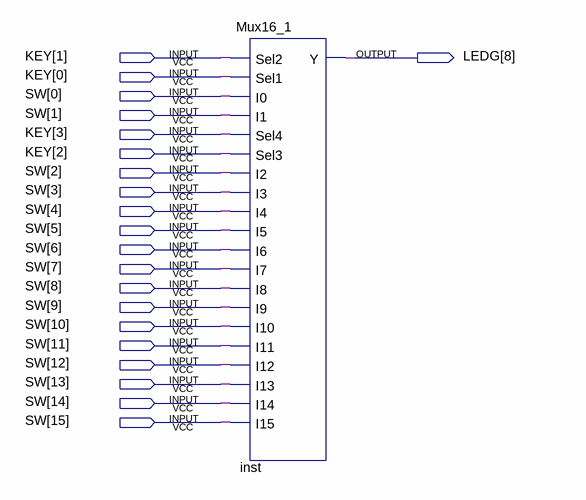
[diagram p0: schematic sheet]
// Quartus schematic MuxDemo.bdf as structural Verilog: 1 symbols, 21 pins
module MuxDemo (
  input  [3:0] KEY,
  input  [15:0] SW,
  output [8:8] LEDG
);

  Mux16_1 inst (
    .Sel2(KEY[1]), .Sel1(KEY[0]), .I0(SW[0]), .I1(SW[1]), .Sel4(KEY[3]), .Sel3(KEY[2]), .I2(SW[2]),
    .I3(SW[3]), .I4(SW[4]), .I5(SW[5]), .I6(SW[6]), .I7(SW[7]), .I8(SW[8]), .I9(SW[9]), .I10(SW[10]),
    .I11(SW[11]), .I12(SW[12]), .I13(SW[13]), .I14(SW[14]), .I15(SW[15]), .Y(LEDG[8]));
endmodule
